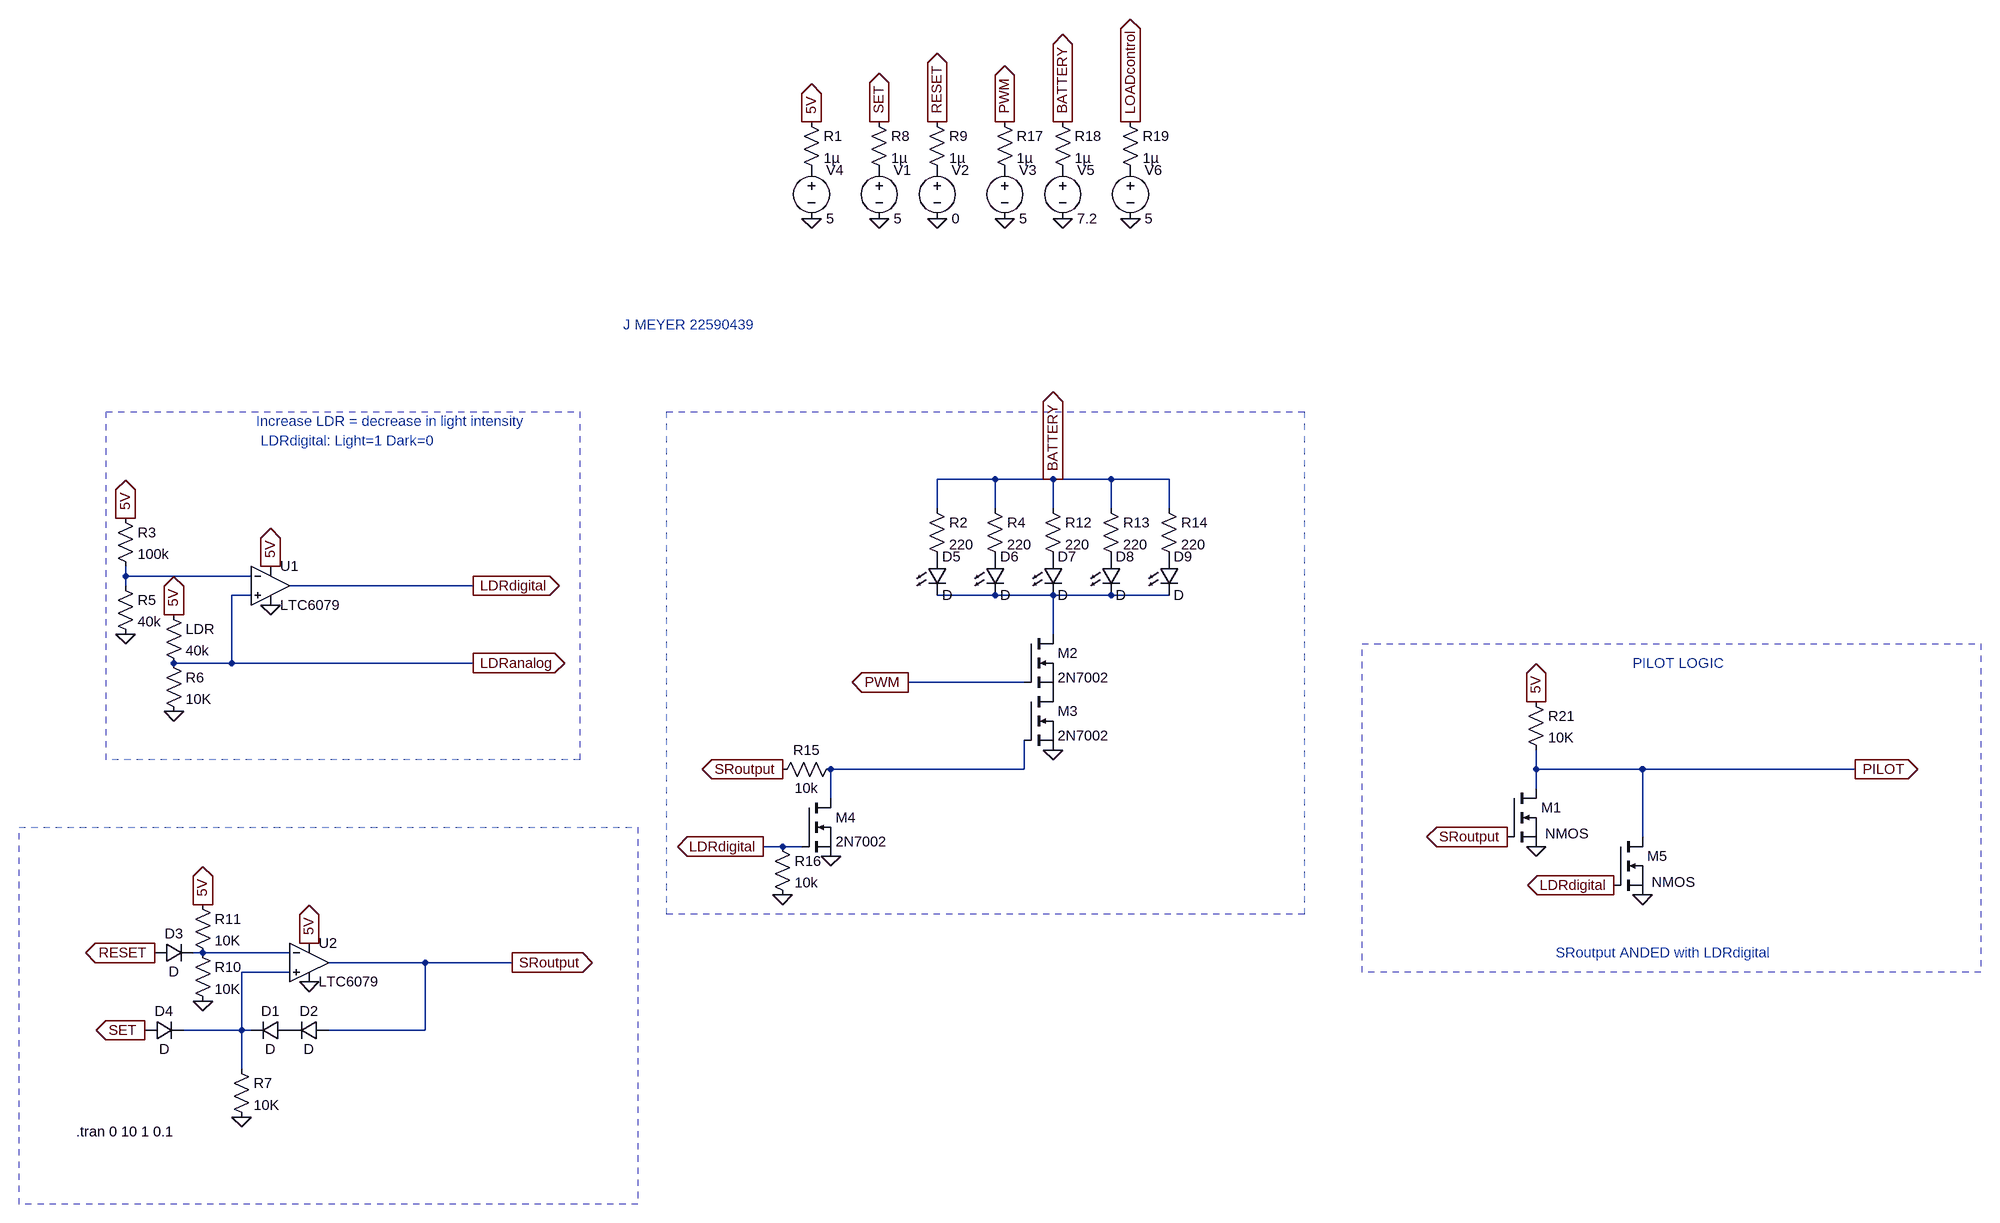
[diagram p0: schematic E344_22590439_A7.asc]
E344_22590439_A7.asc, the LTspice schematic file:
Version 4
SHEET 1 5060 1220
WIRE 3424 16 3328 16
WIRE 3520 16 3424 16
WIRE 3616 16 3520 16
WIRE 3712 16 3616 16
WIRE 3328 64 3328 16
WIRE 3424 64 3424 16
WIRE 3520 64 3520 16
WIRE 3616 64 3616 16
WIRE 3712 64 3712 16
WIRE 1984 176 1984 160
WIRE 2192 176 1984 176
WIRE 1984 192 1984 176
WIRE 2560 192 2256 192
WIRE 2192 208 2160 208
WIRE 3424 208 3328 208
WIRE 3520 208 3424 208
WIRE 3616 208 3520 208
WIRE 3712 208 3616 208
WIRE 3520 272 3520 208
WIRE 2160 320 2160 208
WIRE 2160 320 2064 320
WIRE 2560 320 2160 320
WIRE 3472 352 3280 352
WIRE 3472 496 3472 448
WIRE 3472 496 3152 496
WIRE 4320 496 4320 464
WIRE 4496 496 4320 496
WIRE 4848 496 4496 496
WIRE 4320 528 4320 496
WIRE 3152 544 3152 496
WIRE 4496 608 4496 496
WIRE 3072 624 3040 624
WIRE 3104 624 3072 624
WIRE 2112 800 2096 800
WIRE 2256 800 2112 800
WIRE 2480 816 2320 816
WIRE 2624 816 2480 816
WIRE 2256 832 2176 832
WIRE 2176 928 2176 832
WIRE 2176 928 2080 928
WIRE 2192 928 2176 928
WIRE 2480 928 2480 816
WIRE 2480 928 2320 928
WIRE 2176 992 2176 928
FLAG 2064 400 0
FLAG 3120 -416 0
FLAG 3120 -576 5V
IOPIN 3120 -576 Out
FLAG 2064 240 5V
IOPIN 2064 240 Out
FLAG 2224 160 5V
IOPIN 2224 160 Out
FLAG 1984 80 5V
IOPIN 1984 80 Out
FLAG 2224 224 0
FLAG 1984 272 0
FLAG 2560 192 LDRdigital
IOPIN 2560 192 Out
FLAG 2288 784 5V
IOPIN 2288 784 Out
FLAG 2288 848 0
FLAG 2176 1072 0
FLAG 3232 -416 0
FLAG 3232 -576 SET
IOPIN 3232 -576 Out
FLAG 3328 -416 0
FLAG 3328 -576 RESET
IOPIN 3328 -576 Out
FLAG 2016 928 SET
IOPIN 2016 928 Out
FLAG 2032 800 RESET
IOPIN 2032 800 Out
FLAG 2112 720 5V
IOPIN 2112 720 Out
FLAG 2112 880 0
FLAG 2624 816 SRoutput
IOPIN 2624 816 Out
FLAG 2560 320 LDRanalog
IOPIN 2560 320 Out
FLAG 3072 496 SRoutput
IOPIN 3072 496 Out
FLAG 3040 624 LDRdigital
IOPIN 3040 624 Out
FLAG 3152 640 0
FLAG 3072 704 0
FLAG 3440 -416 0
FLAG 3440 -576 PWM
IOPIN 3440 -576 Out
FLAG 3536 -416 0
FLAG 3536 -576 BATTERY
IOPIN 3536 -576 Out
FLAG 3648 -416 0
FLAG 3648 -576 LOADcontrol
IOPIN 3648 -576 Out
FLAG 3280 352 PWM
IOPIN 3280 352 Out
FLAG 3520 16 BATTERY
IOPIN 3520 16 Out
FLAG 3520 464 0
FLAG 4272 608 SRoutput
IOPIN 4272 608 Out
FLAG 4448 688 LDRdigital
IOPIN 4448 688 Out
FLAG 4320 624 0
FLAG 4496 704 0
FLAG 4848 496 PILOT
IOPIN 4848 496 Out
FLAG 4320 384 5V
IOPIN 4320 384 Out
SYMBOL res 2048 224 R0
SYMATTR InstName LDR
SYMATTR Value 40k
SYMBOL res 2048 304 R0
SYMATTR InstName R6
SYMATTR Value 10K
SYMBOL Opamps\\LTC6079 2224 192 R0
SYMATTR InstName U1
SYMBOL voltage 3120 -512 R0
WINDOW 123 0 0 Left 0
WINDOW 39 0 0 Left 0
SYMATTR InstName V4
SYMATTR Value 5
SYMBOL res 3104 -592 R0
SYMATTR InstName R1
SYMATTR Value 1µ
SYMBOL res 1968 64 R0
SYMATTR InstName R3
SYMATTR Value 100k
SYMBOL res 1968 176 R0
SYMATTR InstName R5
SYMATTR Value 40k
SYMBOL Opamps\\LTC6079 2288 816 R0
SYMATTR InstName U2
SYMBOL diode 2256 912 R90
WINDOW 0 0 32 VBottom 2
WINDOW 3 32 32 VTop 2
SYMATTR InstName D1
SYMBOL diode 2320 912 R90
WINDOW 0 0 32 VBottom 2
WINDOW 3 32 32 VTop 2
SYMATTR InstName D2
SYMBOL diode 2032 816 R270
WINDOW 0 32 32 VTop 2
WINDOW 3 0 32 VBottom 2
SYMATTR InstName D3
SYMBOL diode 2016 944 R270
WINDOW 0 32 32 VTop 2
WINDOW 3 0 32 VBottom 2
SYMATTR InstName D4
SYMBOL res 2160 976 R0
SYMATTR InstName R7
SYMATTR Value 10K
SYMBOL voltage 3232 -512 R0
WINDOW 123 0 0 Left 0
WINDOW 39 0 0 Left 0
SYMATTR InstName V1
SYMATTR Value 5
SYMBOL res 3216 -592 R0
SYMATTR InstName R8
SYMATTR Value 1µ
SYMBOL voltage 3328 -512 R0
WINDOW 123 0 0 Left 0
WINDOW 39 0 0 Left 0
SYMATTR InstName V2
SYMATTR Value 0
SYMBOL res 3312 -592 R0
SYMATTR InstName R9
SYMATTR Value 1µ
SYMBOL res 2096 784 R0
SYMATTR InstName R10
SYMATTR Value 10K
SYMBOL res 2096 704 R0
SYMATTR InstName R11
SYMATTR Value 10K
SYMBOL res 3312 48 R0
SYMATTR InstName R2
SYMATTR Value 220
SYMBOL res 3408 48 R0
SYMATTR InstName R4
SYMATTR Value 220
SYMBOL res 3504 48 R0
SYMATTR InstName R12
SYMATTR Value 220
SYMBOL res 3600 48 R0
SYMATTR InstName R13
SYMATTR Value 220
SYMBOL res 3696 48 R0
SYMATTR InstName R14
SYMATTR Value 220
SYMBOL LED 3312 144 R0
SYMATTR InstName D5
SYMBOL LED 3408 144 R0
SYMATTR InstName D6
SYMBOL LED 3504 144 R0
SYMATTR InstName D7
SYMBOL LED 3600 144 R0
SYMATTR InstName D8
SYMBOL LED 3696 144 R0
SYMATTR InstName D9
SYMBOL nmos 4272 528 R0
WINDOW 3 63 75 Left 2
SYMATTR InstName M1
SYMBOL nmos 3472 272 R0
SYMATTR InstName M2
SYMATTR Value 2N7002
SYMBOL nmos 3472 368 R0
SYMATTR InstName M3
SYMATTR Value 2N7002
SYMBOL nmos 3104 544 R0
SYMATTR InstName M4
SYMATTR Value 2N7002
SYMBOL res 3168 480 R90
WINDOW 0 0 56 VBottom 2
WINDOW 3 32 56 VTop 2
SYMATTR InstName R15
SYMATTR Value 10k
SYMBOL res 3056 608 R0
SYMATTR InstName R16
SYMATTR Value 10k
SYMBOL voltage 3440 -512 R0
WINDOW 123 0 0 Left 0
WINDOW 39 0 0 Left 0
SYMATTR InstName V3
SYMATTR Value 5
SYMBOL res 3424 -592 R0
SYMATTR InstName R17
SYMATTR Value 1µ
SYMBOL voltage 3536 -512 R0
WINDOW 123 0 0 Left 0
WINDOW 39 0 0 Left 0
SYMATTR InstName V5
SYMATTR Value 7.2
SYMBOL res 3520 -592 R0
SYMATTR InstName R18
SYMATTR Value 1µ
SYMBOL voltage 3648 -512 R0
WINDOW 123 0 0 Left 0
WINDOW 39 0 0 Left 0
SYMATTR InstName V6
SYMATTR Value 5
SYMBOL res 3632 -592 R0
SYMATTR InstName R19
SYMATTR Value 1µ
SYMBOL nmos 4448 608 R0
WINDOW 3 63 75 Left 2
SYMATTR InstName M5
SYMBOL res 4304 368 R0
SYMATTR InstName R21
SYMATTR Value 10K
TEXT 2200 -80 Left 2 ;Increase LDR = decrease in light intensity
TEXT 2208 -48 Left 2 ;LDRdigital: Light=1 Dark=0
TEXT 1902 1096 Left 2 !.tran 0 10 1 0.1
TEXT 4480 320 Left 2 ;PILOT LOGIC
TEXT 4352 800 Left 2 ;SRoutput ANDED with LDRdigital
TEXT 2808 -240 Left 2 ;J MEYER 22590439
LINE Normal 1952 480 1952 -96 3
LINE Normal 2736 480 1952 480 3
LINE Normal 2736 -96 2736 480 3
LINE Normal 1952 -96 2736 -96 3
LINE Normal 1808 1216 1808 592 3
LINE Normal 2832 1216 1808 1216 3
LINE Normal 2832 592 2832 1216 3
LINE Normal 1808 592 2832 592 3
RECTANGLE Normal 3936 736 2880 -96 3
RECTANGLE Normal 5056 832 4032 288 3

The netlist it stands for:
* E344_22590439_A7.asc
R§LDR 5V LDRanalog 40k
R6 LDRanalog 0 10K
XU1 LDRanalog N001 5V 0 LDRdigital LTC6078  ; LTC6079, pins In+ In- V+ V- OUT
V4 P001 0 5
R1 5V P001 1µ
R3 5V N001 100k
R5 N001 0 40k
XU2 N005 N004 5V 0 SRoutput LTC6078  ; LTC6079, pins In+ In- V+ V- OUT
D1 P002 N005 D
D2 SRoutput P002 D
D3 RESET N004 D
D4 SET N005 D
R7 N005 0 10K
V1 P003 0 5
R8 SET P003 1µ
V2 P004 0 0
R9 RESET P004 1µ
R10 N004 0 10K
R11 5V N004 10K
R2 BATTERY P005 220
R4 BATTERY P006 220
R12 BATTERY P007 220
R13 BATTERY P008 220
R14 BATTERY P009 220
D5 P005 N002 D
D6 P006 N002 D
D7 P007 N002 D
D8 P008 N002 D
D9 P009 N002 D
M1 PILOT SRoutput 0 0 NMOS
M2 N002 PWM P010 P010 2N7002
M3 P010 N003 0 0 2N7002
M4 N003 LDRdigital 0 0 2N7002
R15 N003 SRoutput 10k
R16 LDRdigital 0 10k
V3 P011 0 5
R17 PWM P011 1µ
V5 P012 0 7.2
R18 BATTERY P012 1µ
V6 P013 0 5
R19 LOADcontrol P013 1µ
M5 PILOT LDRdigital 0 0 NMOS
R21 5V PILOT 10K
.model D D
.lib standard.dio
.model NMOS NMOS
.model PMOS PMOS
.lib standard.mos
* Increase LDR = decrease in light intensity
* LDRdigital: Light=1 Dark=0
.tran 0 10 1 0.1
* PILOT LOGIC
* SRoutput ANDED with LDRdigital
* J MEYER 22590439
.lib LTC5.lib
.backanno
.end